# Altium schematic sheet Main Board.SchDoc: ECG Main Board
size A4; Author: Tomás Valencia/Samuel López; DrawnBy: Tomás Valencia; DocumentNumber: 1; SheetNumber: 1; SheetTotal: 6
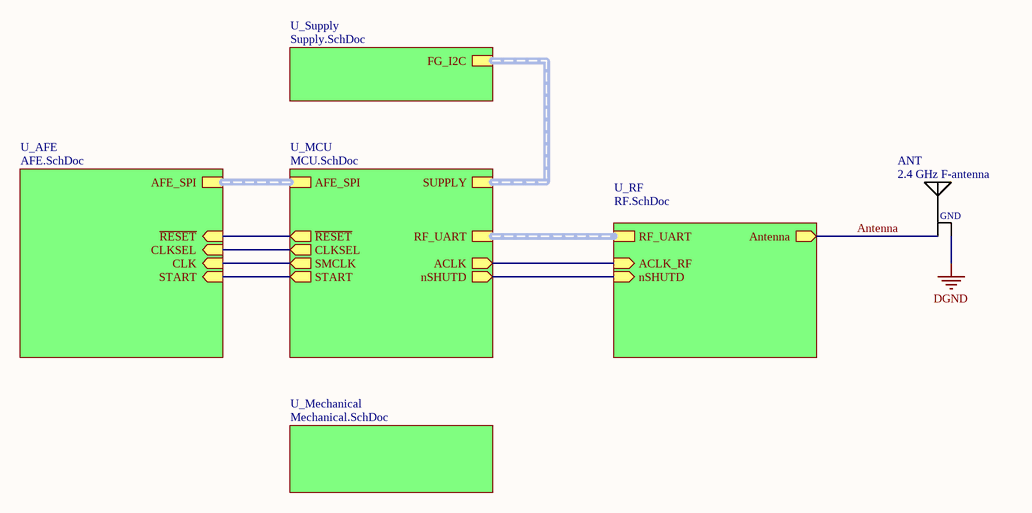
[diagram p0: Main Board.SchDoc]

## Parts
ANT  2.4 GHz F-antenna  [Antenna]  (no BOM)

## Sub-sheets
U_AFE = AFE.SchDoc: AFE_SPI (harness AFE_SPI), CLKSEL (in), CLK (in), START (in), ~{RESET} (in)
U_MCU = MCU.SchDoc: AFE_SPI (harness AFE_SPI), RF_UART (harness RF_UART), ACLK (out), SUPPLY (harness SUPPLY), SMCLK (out), CLKSEL (out), START (out), nSHUTD (out), ~{RESET} (out)
U_Mechanical = Mechanical.SchDoc: no entries
U_RF = RF.SchDoc: RF_UART (harness RF_UART), ACLK_RF (in), Antenna (out), nSHUTD (in)
U_Supply = Supply.SchDoc: FG_I2C (harness SUPPLY)

## Nets
DGND: ANT.2(GND)
Antenna: ANT.1(IN) ; sheet U_RF/Antenna
(unnamed): sheet U_AFE/CLKSEL, sheet U_MCU/CLKSEL
(unnamed): sheet U_AFE/CLK, sheet U_MCU/SMCLK
(unnamed): sheet U_AFE/START, sheet U_MCU/START
(unnamed): sheet U_AFE/~{RESET}, sheet U_MCU/~{RESET}
(unnamed): sheet U_MCU/ACLK, sheet U_RF/ACLK_RF
(unnamed): sheet U_MCU/nSHUTD, sheet U_RF/nSHUTD

## Buses and harness runs
harness sheet U_AFE/AFE_SPI = sheet U_MCU/AFE_SPI
harness sheet U_MCU/RF_UART = sheet U_RF/RF_UART
harness sheet U_MCU/SUPPLY = sheet U_Supply/FG_I2C

## Library data of the parts
ANT = Antenna